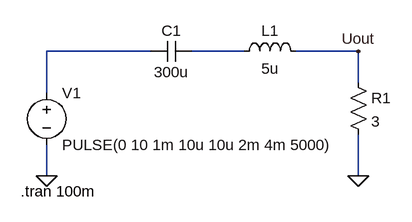
[diagram p0: schematic Draft1.asc]
Draft1.asc, the LTspice schematic file:
Version 4.1
SHEET 1 880 680
WIRE 256 96 96 96
WIRE 400 96 320 96
WIRE 576 96 480 96
WIRE 576 144 576 96
WIRE 96 160 96 96
WIRE 96 288 96 240
WIRE 576 288 576 224
FLAG 576 288 0
FLAG 96 288 0
FLAG 576 96 Uout
SYMBOL voltage 96 144 R0
WINDOW 123 0 0 Left 0
WINDOW 39 0 0 Left 0
SYMATTR InstName V1
SYMATTR Value PULSE(0 10 1m 10u 10u 2m 4m 5000)
SYMBOL cap 320 80 R90
WINDOW 0 0 32 VBottom 2
WINDOW 3 32 32 VTop 2
SYMATTR InstName C1
SYMATTR Value 300u
SYMBOL ind 384 112 R270
WINDOW 0 32 56 VTop 2
WINDOW 3 5 56 VBottom 2
SYMATTR InstName L1
SYMATTR Value 5u
SYMBOL res 560 128 R0
SYMATTR InstName R1
SYMATTR Value 3
TEXT 56 312 Left 2 !.tran 100m

The netlist it stands for:
* Draft1.asc
V1 N001 0 PULSE(0 10 1m 10u 10u 2m 4m 5000)
C1 N002 N001 300u
L1 N002 Uout 5u
R1 Uout 0 3
.tran 100m
.backanno
.end